# EAGLE design pcb1c (EAGLE 9.6.2)
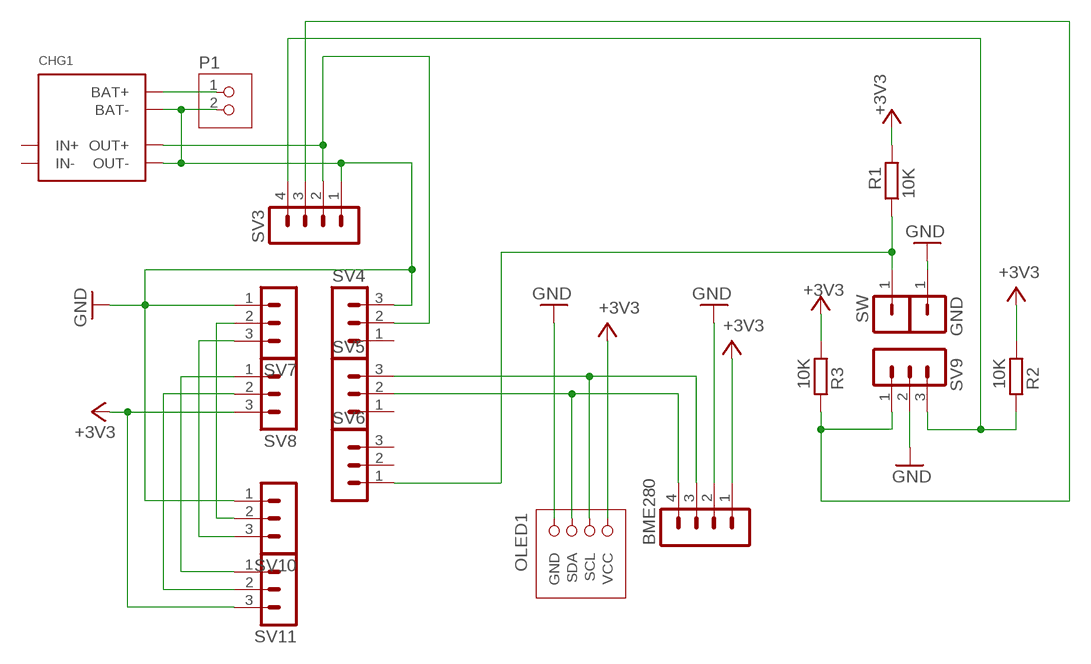
[diagram p0: schematic, sheet 1]

## Parts
BME280  PINHEAD-MA04-1  [PINHEAD-MA04-1]
CHG1  TP4056MOD2-TYPE-C  [TP4056MOD2-TYPE-C]
GND  PINHEAD-MA01-1  [PINHEAD-MA01-1]
OLED1  OLED-SSD1306-0.96  [OLED-I2C-0.96]
P1  JST-PH2  [JST-PH2]
R1  10K  R-EU_0204/5  [0204/5]
R2  10K  R-EU_0204/5  [0204/5]
R3  10K  R-EU_0204/5  [0204/5]
SV3  PINHEAD-MA04-1  [PINHEAD-MA04-1]
SV4  PINHEAD-MA03-1  [PINHEAD-MA03-1]
SV5  PINHEAD-MA03-1  [PINHEAD-MA03-1]
SV6  PINHEAD-MA03-1  [PINHEAD-MA03-1]
SV7  PINHEAD-MA03-1  [PINHEAD-MA03-1]
SV8  PINHEAD-MA03-1  [PINHEAD-MA03-1]
SV9  PINHEAD-MA03-1  [PINHEAD-MA03-1]
SV10  PINHEAD-MA03-1  [PINHEAD-MA03-1]
SV11  PINHEAD-MA03-1  [PINHEAD-MA03-1]
SW  PINHEAD-MA01-1  [PINHEAD-MA01-1]

## Nets
+3V3: BME280.1 OLED1.VCC R1.2 R2.1 R3.1 SV8.3 SV11.3
GND: BME280.2 CHG1.BAT- CHG1.OUT- GND.1 OLED1.GND P1.2 SV3.1 SV4.3 SV7.1 SV9.2 SV10.1
N$1: R3.2 SV3.3 SV9.1
N$2: BME280.3 OLED1.SCL SV5.3
N$3: BME280.4 OLED1.SDA SV5.2
N$4: SV7.2 SV10.2
N$5: CHG1.OUT+ SV3.2 SV4.2
N$6: R2.2 SV3.4 SV9.3
N$7: SV7.3 SV10.3
N$8: SV8.1 SV11.1
N$9: SV8.2 SV11.2
N$10: R1.1 SV6.1 SW.1
N$11: CHG1.BAT+ P1.1
Unconnected: CHG1.IN+ CHG1.IN- SV4.1 SV5.1 SV6.2 SV6.3

## Library data of the parts
BME280 SV3 = ytani1:PINHEAD-MA04-1: PIN HEADER; OC_FARNELL: unknown; OC_NEWARK: unknown
CHG1 = ytani1:TP4056MOD2-TYPE-C: リチウム電池充電器モジュール Type-C(TP4056) <https://www.amazon.co.jp/gp/product/B07QTQ46XN>
GND SW = ytani1:PINHEAD-MA01-1
OLED1 = ytani1:OLED-SSD1306-0.96: OLED SSD1306 0.96inch 128x96 I2C https://akizukidenshi.com/catalog/g/gP-12031/ Vcc: 3V-5.5V I2C addr: 0x3C Control chip: SSD1306 Blank/White; OC_AKIZUKI: P-12031; URL_AKIZUKI: https://akizukidenshi.com/catalog/g/gP-12031/
P1 = ytani1:JST-PH2
R1-R3 = rcl:R-EU_: RESISTOR, European symbol; SPICEPREFIX: R
SV4-SV11 = ytani1:PINHEAD-MA03-1: PIN HEADER; OC_FARNELL: unknown; OC_NEWARK: unknown

## Board
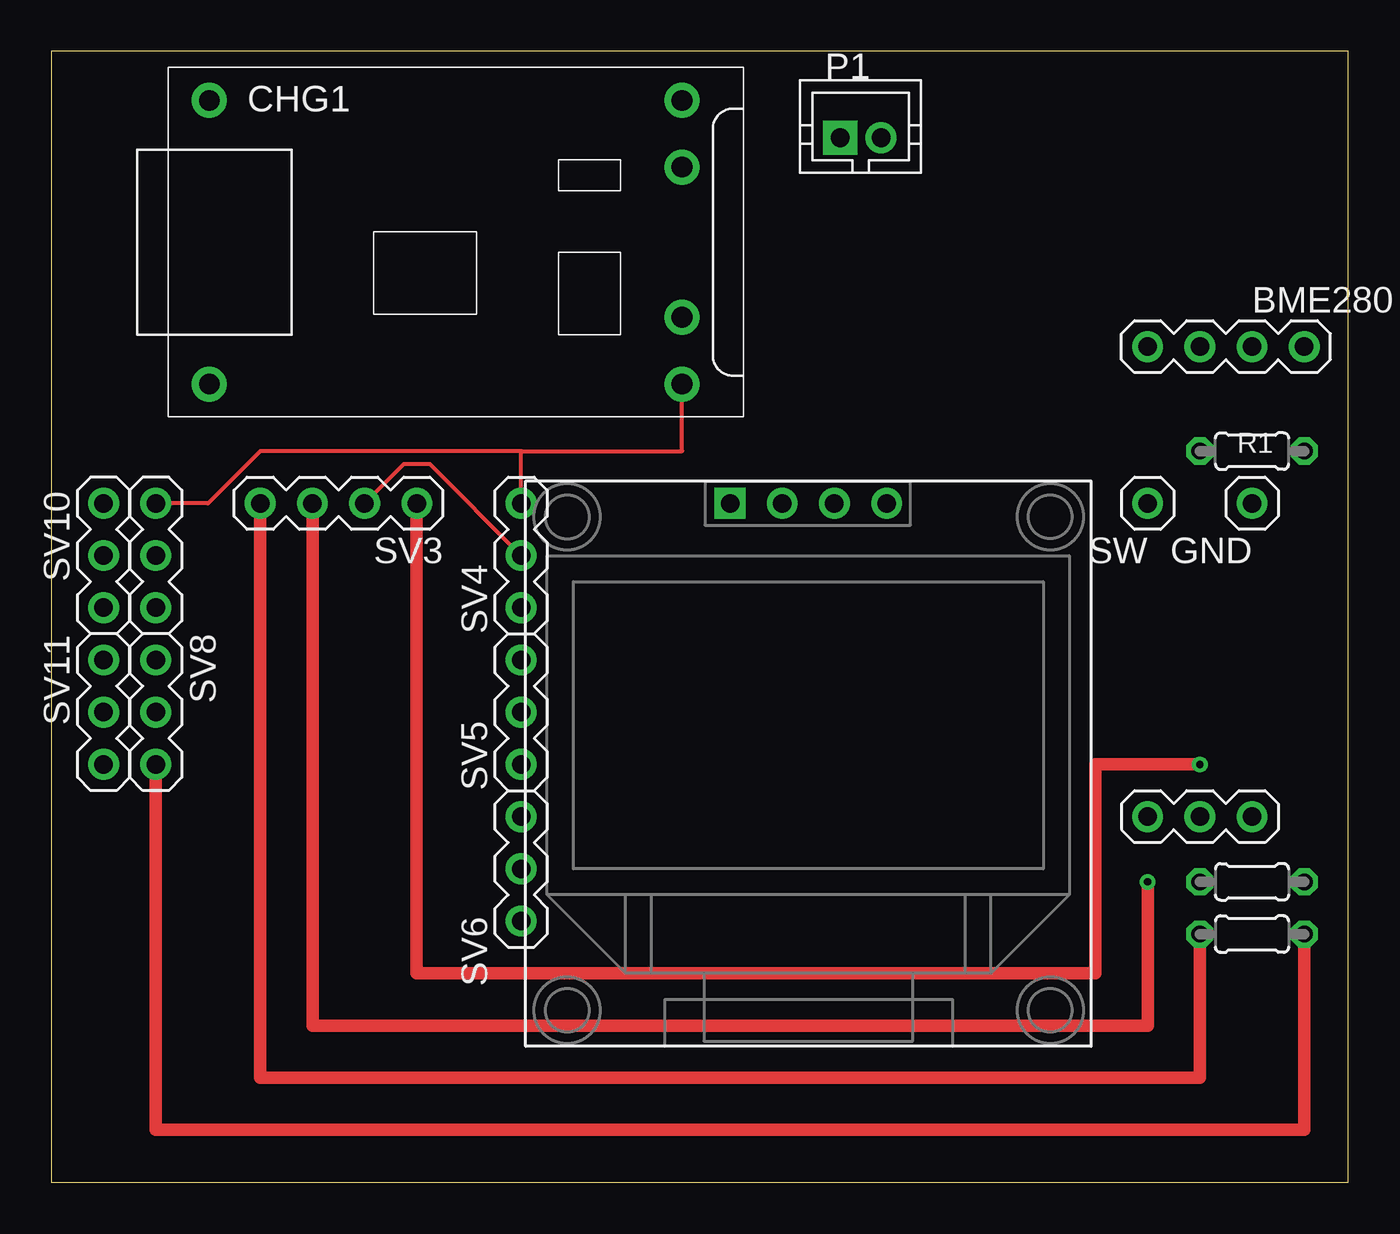
[diagram p1: board, top side]
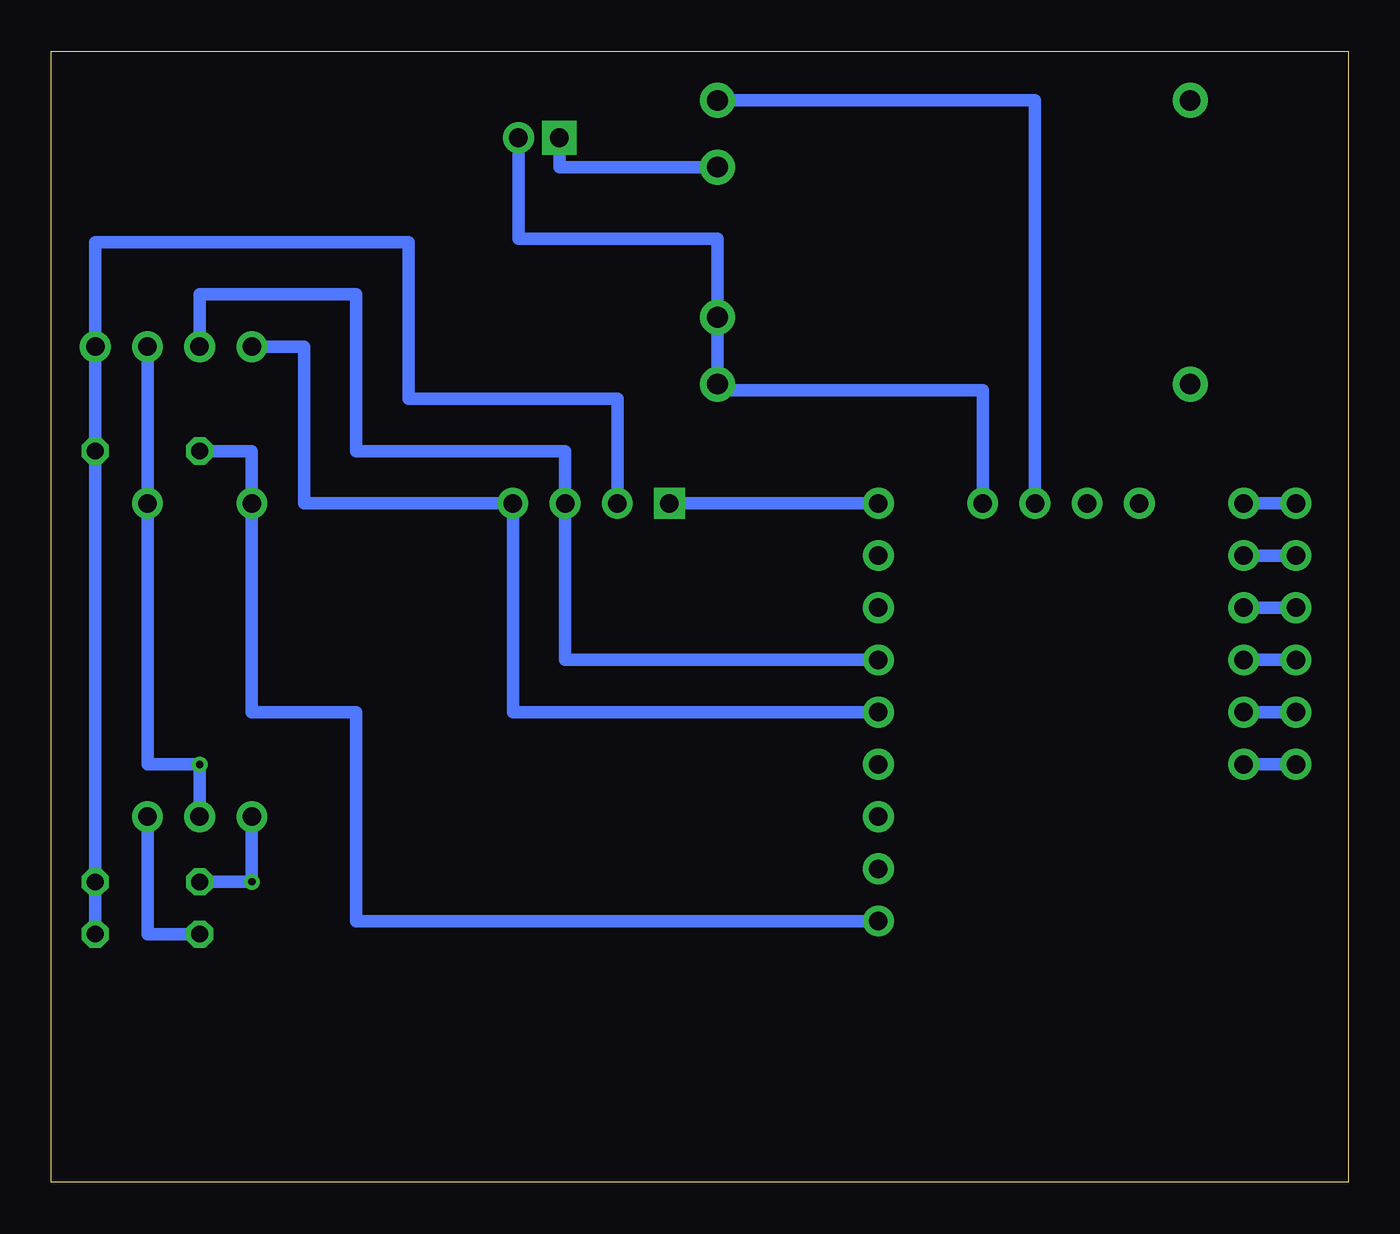
[diagram p2: board, bottom side, seen from below]

Size 63.09 x 55 mm. Coordinates in mm from the lower left corner, seen from the top.
Outline: 0,0 63.09,0 63.09,55 0,55 0,0
Copper layers (1*16): Top 0.035mm / dielectric 1.5mm / Bottom 0.035mm
Design rules "default": minimum track width 6mil, minimum drill 0.35mm, track to track 6mil, track to pad 6mil, pad to pad 6mil, via to via 6mil, smd to smd 6mil, copper to edge 40mil, drill to drill 6mil, minimum pad ring 10mil, minimum via ring 8mil, stop-mask expansion 4mil, vias tented up to drill 0mil, thermal gap 10mil

### Footprints (pad centres in the part's own frame; a part is rotated, then mirrored left to right if it is on the bottom)
PINHEAD-MA04-1 = drill 0.9 pad 1.5: 1 -3.81,0; 2 -1.27,0; 3 1.27,0; 4 3.81,0
TP4056MOD2-TYPE-C = drill 1 pad 1.7: BAT+ 11,3.65; BAT- 11,-3.65; IN+ -12,6.9; IN- -12,-6.9; OUT+ 11,6.9; OUT- 11,-6.9
PINHEAD-MA01-1 = drill 0.9 pad 1.5: 1 1.27,0
OLED-I2C-0.96 = drill 0.9 pad 1.5 square: GND -5.08,10.16 | drill 0.9 pad 1.5: SCL 0,10.16; SDA 2.54,10.16; VCC -2.54,10.16
JST-PH2 = drill 0.9 pad 1.676 square: 1 -1,0 | drill 0.9 pad 1.5: 2 1,0
0204/5 = drill 0.813 octagon: 1 -2.54,0; 2 2.54,0
PINHEAD-MA03-1 = drill 0.9 pad 1.5: 1 -1.27,0; 2 1.27,0; 3 3.81,0

### Placement (x,y rotation side)
BME280  57.15,40.64 180 top
CHG1  19.68,45.72 0 top
GND  57.15,33.02 0 top
OLED1  38.1,22.86 0 top
P1  39.37,50.8 0 top
R1  58.42,35.56 0 top
R2  58.42,12.06 180 top
R3  58.42,14.61 180 top
SV3  13.97,33.02 180 top
SV4  22.86,29.21 90 top
SV5  22.86,21.59 90 top
SV6  22.86,13.97 90 top
SV7  5.08,31.75 270 top
SV8  5.08,24.13 270 top
SV9  54.61,17.78 0 top
SV10  2.54,31.75 270 top
SV11  2.54,24.13 270 top
SW  52.07,33.02 0 top

### Tracks (layer width: path | path; a pad name or v marks a point on that pad's centre or on a via)
+3V3
  Top 0.61: SV8.3 5.08,2.54 60.96,2.54 R2.1
  Bottom 0.61: SV8.3 SV11.3 | R2.1 R3.1 R1.2 BME280.1 60.96,45.72 45.72,45.72 45.72,38.1 35.56,38.1 OLED1.VCC
GND  (via drill 0.35)
  Top 0.2: 22.86,35.56 10.16,35.56 7.62,33.02 SV7.1 | SV4.3 22.86,35.56 | 22.86,35.56 30.68,35.56 CHG1.OUT-
  Top 0.61: SV3.1 17.78,10.16 50.8,10.16 50.8,20.32 v55.88,20.32
  Bottom 0.61: SV7.1 SV10.1 | SV9.2 v55.88,20.32 58.42,20.32 GND.1 BME280.2 | OLED1.GND SV4.3 | P1.2 40.37,45.88 30.68,45.88 CHG1.BAT- CHG1.OUT- 30.38,38.51 17.78,38.51 SV3.1
N$1  (via drill 0.35)
  Top 0.61: SV3.3 12.7,7.62 53.34,7.62 v53.34,14.61
  Bottom 0.61: R3.2 v53.34,14.61 SV9.1
N$2
  Bottom 0.61: SV5.3 38.1,25.4 OLED1.SCL 38.1,35.56 48.26,35.56 48.26,43.18 55.88,43.18 BME280.3
N$3
  Bottom 0.61: SV5.2 40.64,22.86 OLED1.SDA 50.8,33.02 50.8,40.64 BME280.4
N$4
  Bottom 0.61: SV7.2 SV10.2
N$5
  Top 0.2: SV4.2 18.41,34.92 17.14,34.92 SV3.2
  Bottom 0.61: CHG1.OUT+ 15.24,52.62 SV3.2
N$6
  Top 0.61: SV3.4 10.16,5.08 55.88,5.08 R2.2
  Bottom 0.61: SV9.3 58.42,12.06 R2.2
N$7
  Bottom 0.61: SV7.3 SV10.3
N$8
  Bottom 0.61: SV8.1 SV11.1
N$9
  Bottom 0.61: SV8.2 SV11.2
N$10
  Bottom 0.61: SV6.1 48.26,12.7 48.26,22.86 53.34,22.86 SW.1 53.34,35.56 R1.1
N$11
  Bottom 0.61: P1.1 38.37,49.37 CHG1.BAT+